# EAGLE design 1u_panel_breakout (EAGLE 7.6.0)
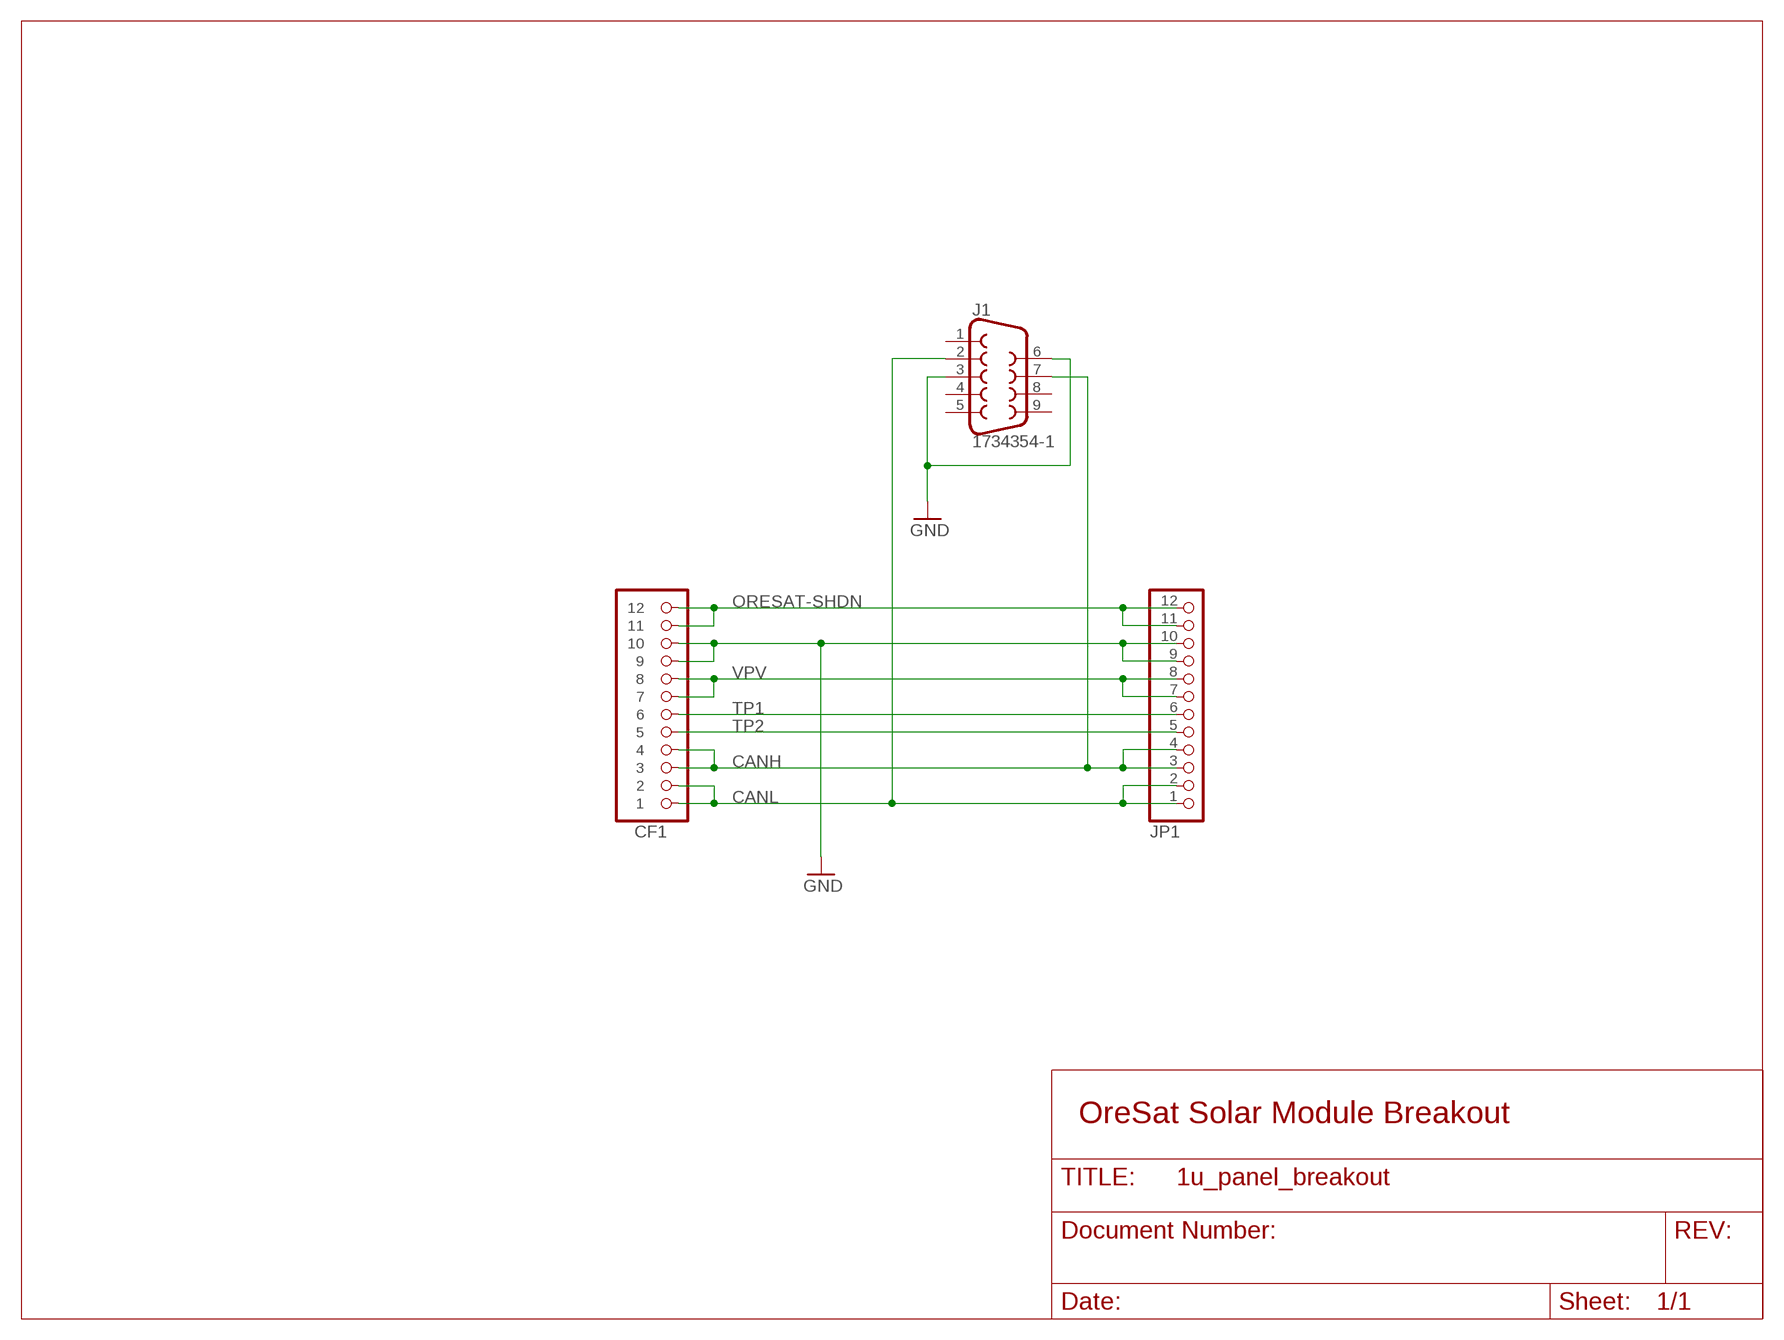
[diagram p0: schematic, sheet 1]

## Parts
CF1  ORESAT-SOLARPANEL-12PIN  [CON-1.27-F-HARTING-1522012X601XXX]
J1  1734354-1  TE_DE9_RECEPTACLE1734354-1  [TE_1734354-1]
JP1  PINHD-1X12  [1X12]

## Nets
CANH: CF1.3 CF1.4 J1.7 JP1.3 JP1.4
CANL: CF1.1 CF1.2 J1.2 JP1.1 JP1.2
GND: CF1.9 CF1.10 J1.3 J1.6 JP1.9 JP1.10
ORESAT-SHDN: CF1.11 CF1.12 JP1.11 JP1.12
TP1: CF1.6 JP1.6
TP2: CF1.5 JP1.5
VPV: CF1.7 CF1.8 JP1.7 JP1.8
Unconnected: J1.1 J1.4 J1.5 J1.8 J1.9

## Notes on the sheet
- OreSat Solar Module Breakout

## Library data of the parts
CF1 = oresat-eagle:ORESAT-SOLARPANEL-12PIN
J1 = TE_Conn_DE9:TE_DE9_RECEPTACLE: TE Conn. DE9 Board-Mount Receptacle (female); PART_NUM: 1734354-1
JP1 = pinhead:PINHD-1X12: PIN HEADER

## Board
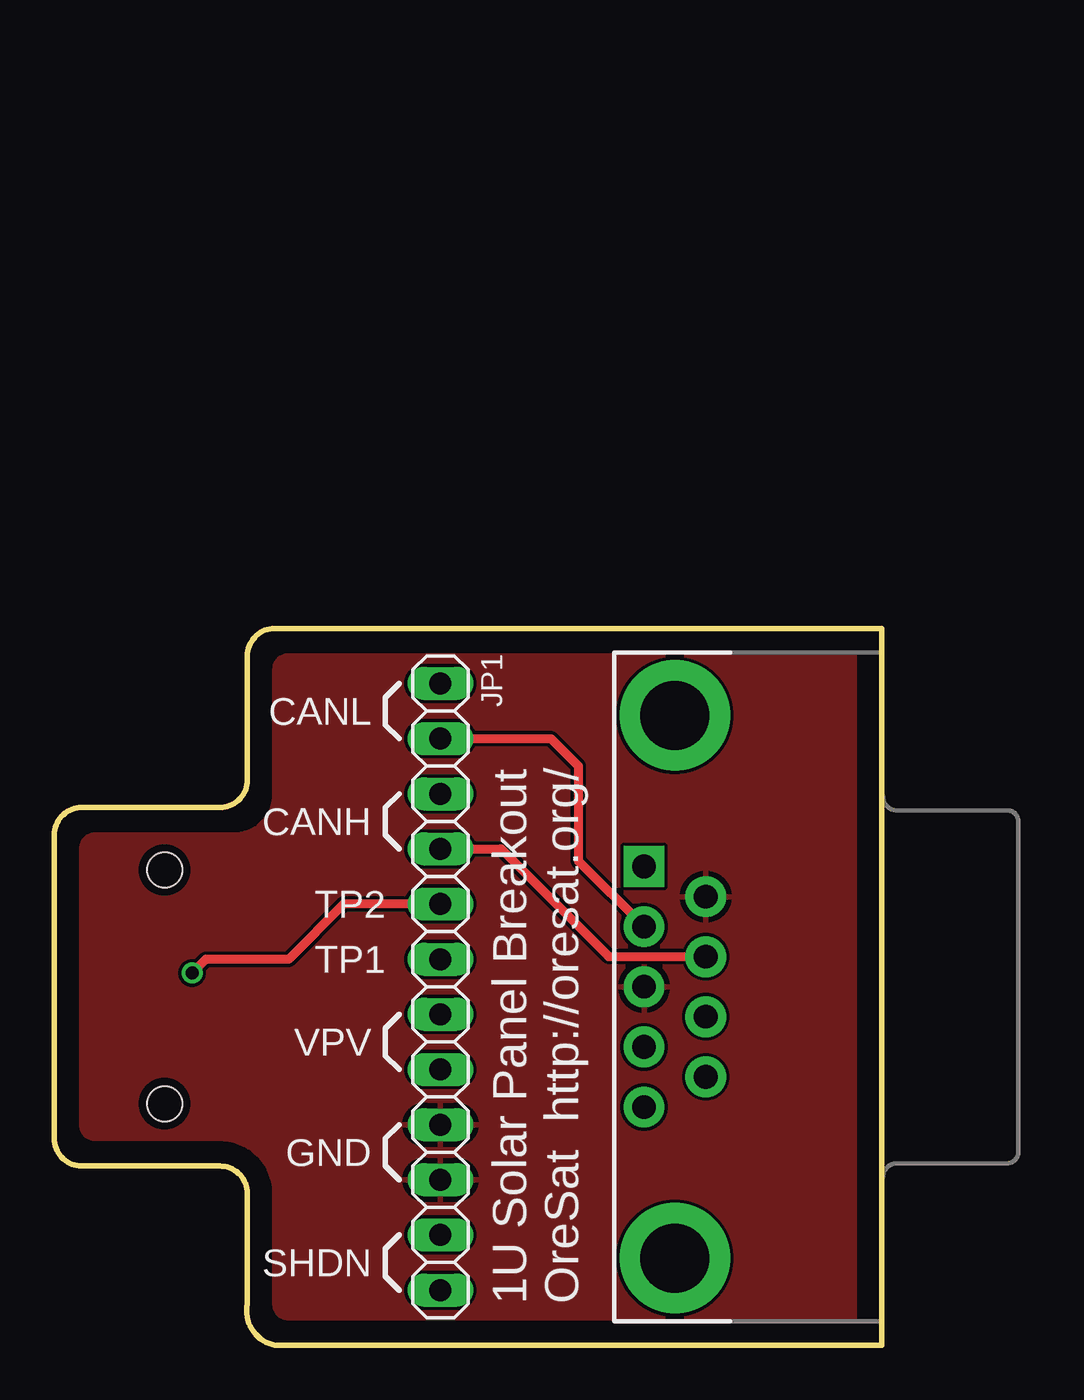
[diagram p1: board, top side]
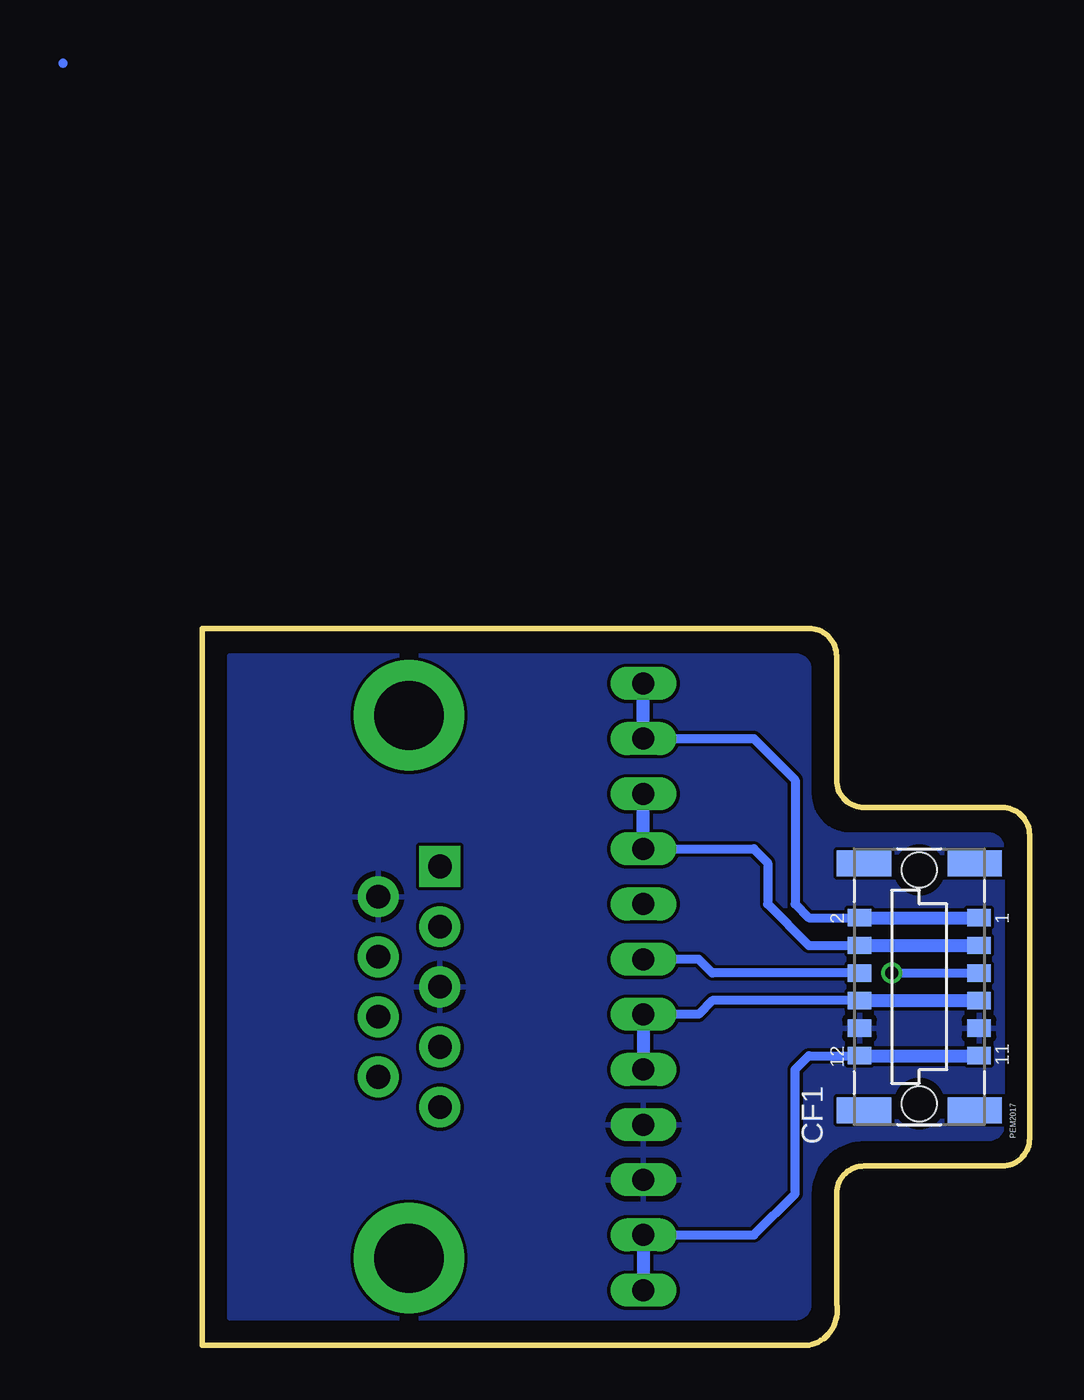
[diagram p2: board, bottom side, seen from below]

Size 38.1 x 33.02 mm. Coordinates in mm from the lower left corner, seen from the top.
Outline: 38.1,33.02 38.1,0 10.16,0 arc-90 8.89,1.91 8.89,6.99 arc90 7.62,8.26 1.27,8.26 arc-90 0,9.53 0,23.49 arc-90 1.27,24.76 7.62,24.76 arc90 8.89,26.04 8.89,31.75 arc-90 10.16,33.02 38.1,33.02
Copper layers (1*16): Top 0.0356mm / dielectric 1.5011mm / Bottom 0.0356mm
Design rules "OSHPark-2layer": minimum track width 6mil, minimum drill 13mil, track to track 6mil, track to pad 6mil, pad to pad 6mil, via to via 6mil, smd to smd 6mil, copper to edge 15mil, drill to drill 6mil, minimum pad ring 7mil, minimum via ring 7mil, stop-mask expansion 2.5mil, vias tented up to drill 0mil, thermal gap 10mil

### Footprints (pad centres in the part's own frame; a part is rotated, then mirrored left to right if it is on the bottom)
CON-1.27-F-HARTING-1522012X601XXX = smd 0.8 x 1.1: 1 3.175,-2.75; 2 3.175,2.75; 3 1.905,-2.75; 4 1.905,2.75; 5 0.635,-2.75; 6 0.635,2.75; 7 -0.635,-2.75; 8 -0.635,2.75; 9 -1.905,-2.75; 10 -1.905,2.75; 11 -3.175,-2.75; 12 -3.175,2.75 | smd 1.2 x 2.5: P$1 -5.685,-2.55; P$2 -5.685,2.55; P$3 5.685,2.55; P$4 5.685,-2.55 | hole 1.6: -5.385,0; 5.385,0
TE_1734354-1 = drill 1.09 pad 1.88 square: 1 -5.54,-1.42 | drill 1.09 pad 1.88: 2 -2.77,-1.42; 3 0,-1.42; 4 2.77,-1.42; 5 5.54,-1.42; 6 -4.15,1.42; 7 -1.38,1.42; 8 1.38,1.42; 9 4.15,1.42 | drill 3.18 pad 5.08: G1 -12.5,0; G2 12.5,0
1X12 = drill 1.016 long: 1 -13.97,0; 2 -11.43,0; 3 -8.89,0; 4 -6.35,0; 5 -3.81,0; 6 -1.27,0; 7 1.27,0; 8 3.81,0; 9 6.35,0; 10 8.89,0; 11 11.43,0; 12 13.97,0

### Placement (x,y rotation side)
CF1  5.08,16.51 90 bottom
J1  28.57,16.51 270 top
JP1  17.78,16.51 270 top

### Tracks (layer width: path | path; a pad name or v marks a point on that pad's centre or on a via)
CANH
  Top 0.406: JP1.4 20.57,22.86 25.53,17.91 29.98,17.91 J1.7
  Bottom 0.406: JP1.4 12.7,22.86 12.07,22.22 12.07,20.32 10.16,18.41 CF1.4
  Bottom 0.61: CF1.4 CF1.3 | JP1.4 JP1.3
CANL
  Top 0.406: JP1.2 22.86,27.94 24.13,26.67 24.13,22.3 J1.2
  Bottom 0.406: JP1.2 12.7,27.94 10.79,26.04 10.79,20.32 10.16,19.68 CF1.2
  Bottom 0.61: CF1.2 CF1.1 | JP1.2 JP1.1
GND
  pour Bottom: 8.26,23.49 arc90 10.16,25.4 10.16,31.11 arc-90 10.79,31.75 36.83,31.75 36.83,1.27 10.79,1.27 arc-90 10.16,1.91 10.16,6.99 arc90 7.62,9.53 1.9,9.53 arc-90 1.27,10.16 1.27,22.86 arc-90 1.9,23.49
  pour Top: 8.26,23.49 arc90 10.16,25.4 10.16,31.11 arc-90 10.79,31.75 36.83,31.75 36.83,1.27 10.79,1.27 arc-90 10.16,1.91 10.16,6.99 arc90 7.62,9.53 1.9,9.53 arc-90 1.27,10.16 1.27,22.86 arc-90 1.9,23.49
N$2
  Bottom 0.406: 44.5,59.03 44.5,59.05
ORESAT-SHDN
  Bottom 0.406: JP1.11 12.7,5.08 10.79,6.99 10.79,12.7 10.16,13.34 CF1.12
  Bottom 0.61: CF1.12 CF1.11 | JP1.11 JP1.12
TP1
  Bottom 0.406: CF1.6 14.61,17.14 15.24,17.78 JP1.6
TP2  (via drill 0.61)
  Top 0.406: JP1.5 13.34,20.32 10.79,17.78 6.99,17.78 v6.35,17.14
  Bottom 0.406: v6.35,17.14 CF1.5
VPV
  Bottom 0.406: CF1.8 14.61,15.88 15.24,15.24 JP1.7
  Bottom 0.61: CF1.8 CF1.7 | JP1.7 JP1.8

### Text on the board
tPlace: CANL | CANH | TP2 | TP1 | VPV | GND | SHDN | 1U Solar Panel Breakout / OreSat http://oresat.org/
bPlace: PEM2017